# EAGLE schematic TestbedV2 (EAGLE 9.5.2)
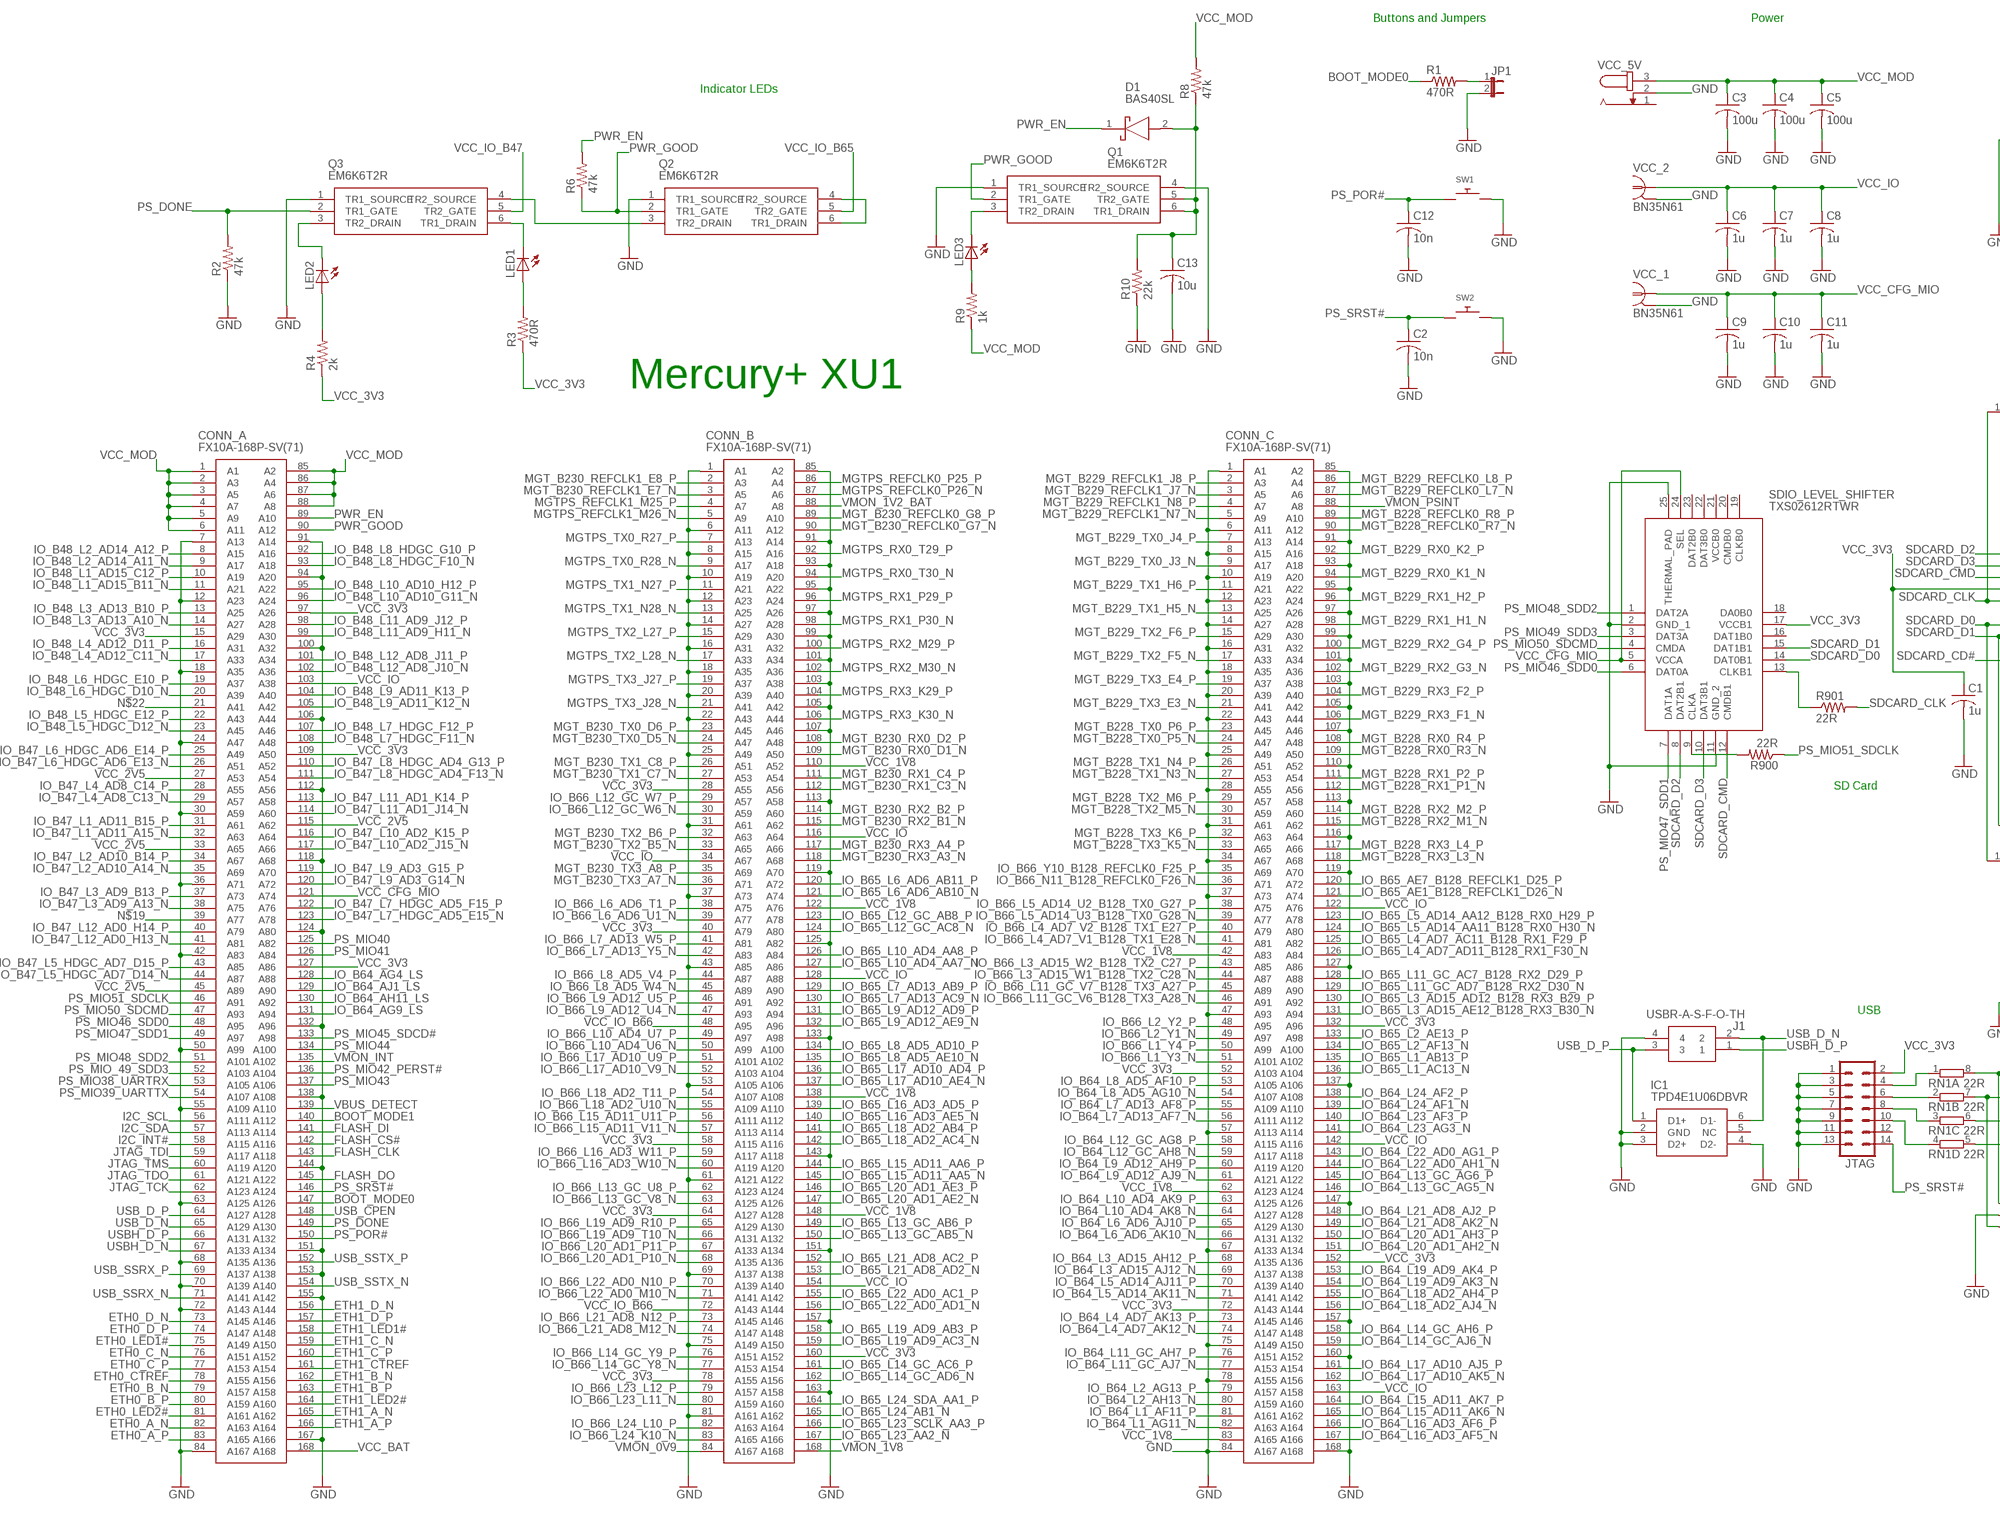
[diagram p0: schematic, sheet 1, part 1 of 2]
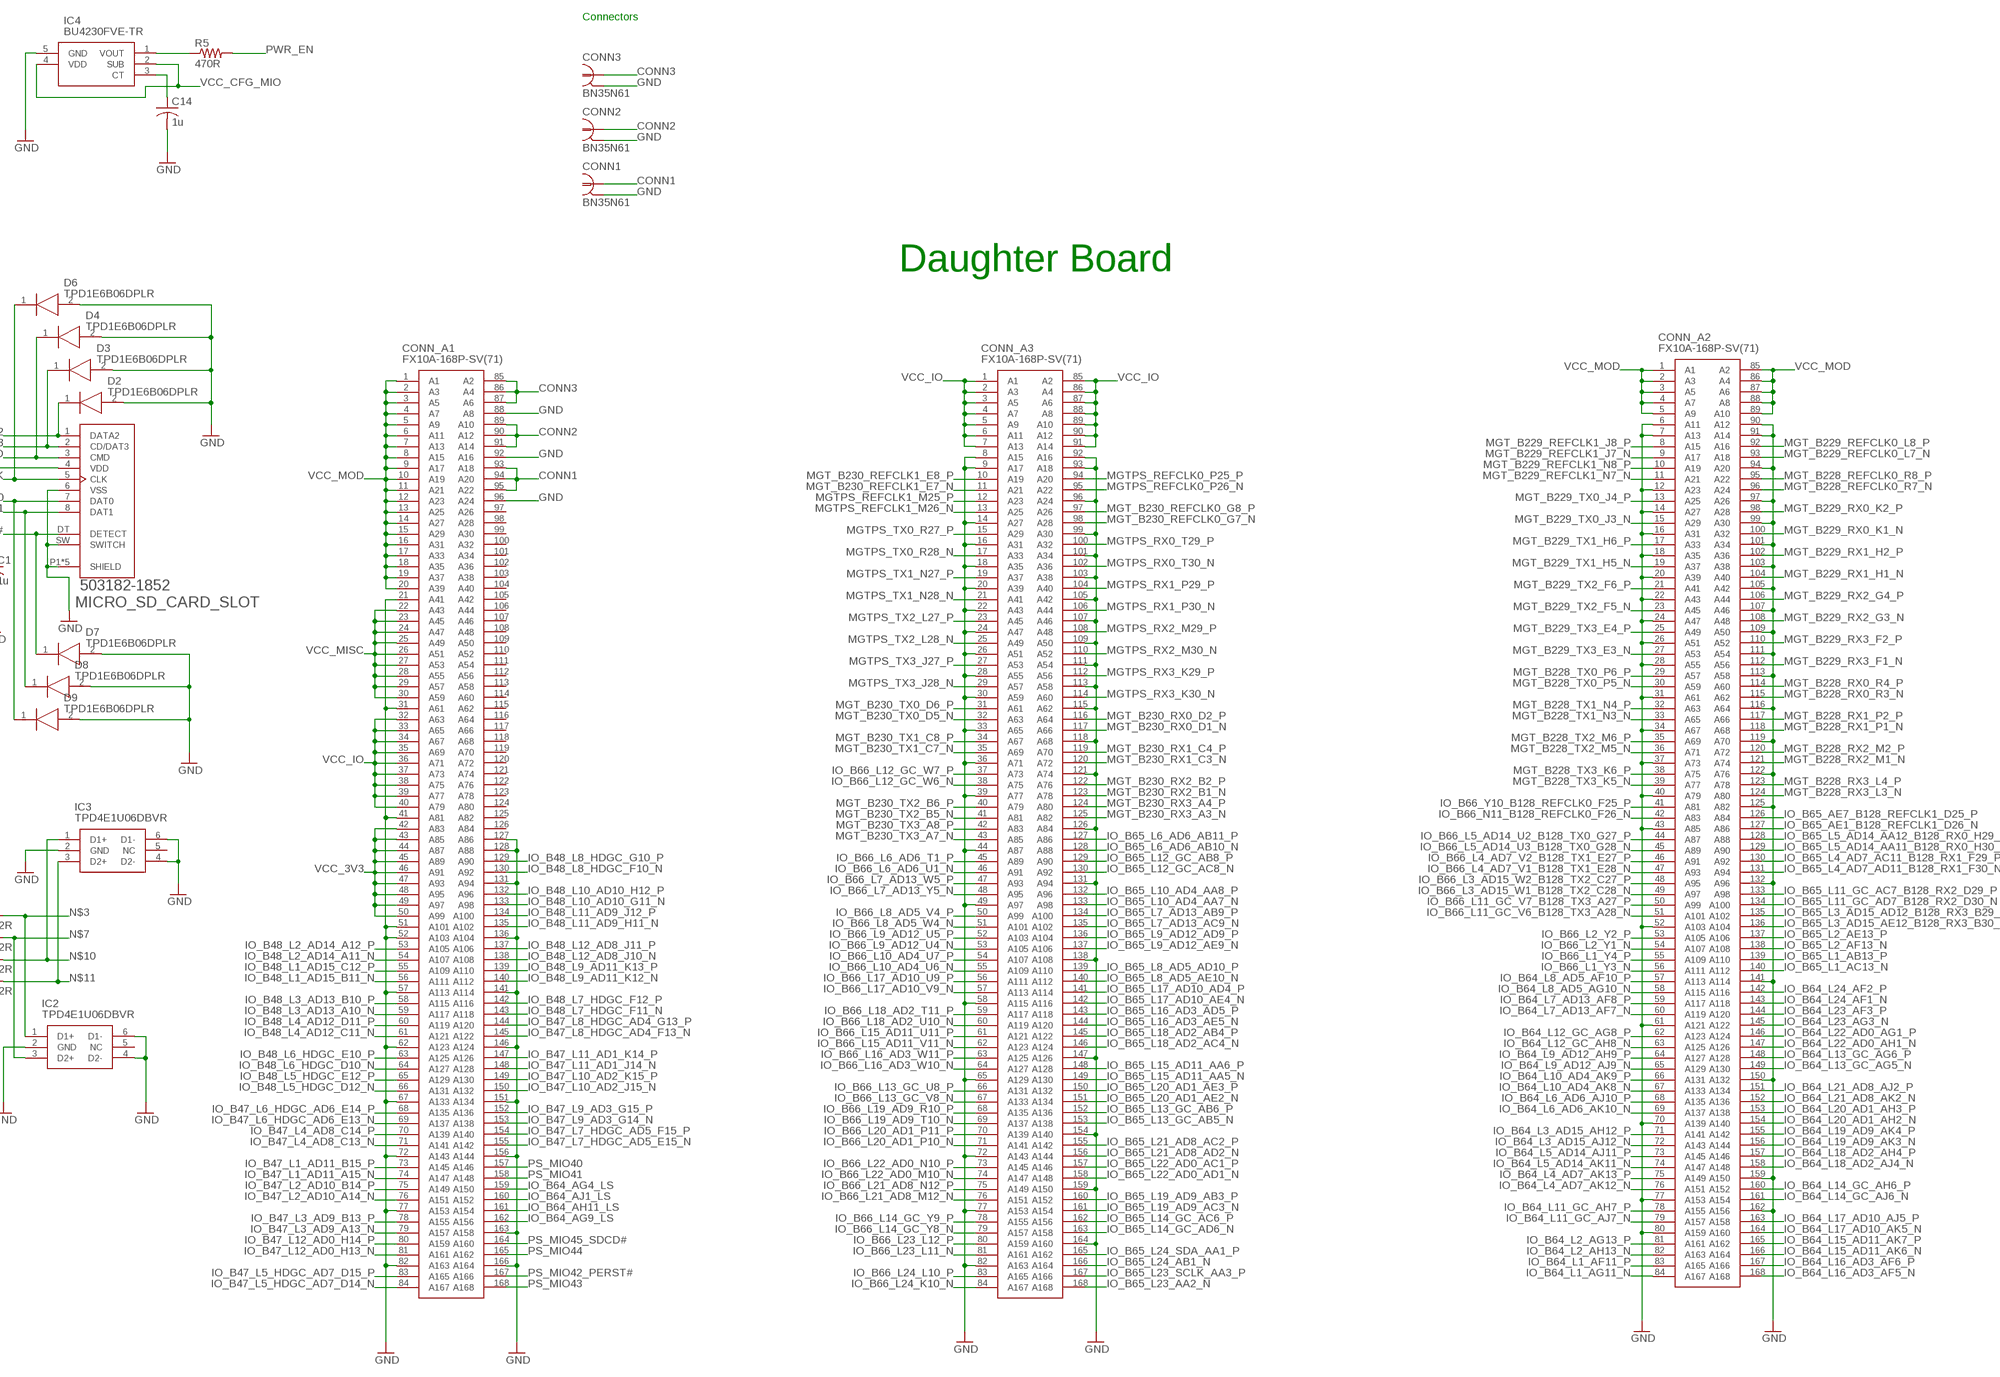
[diagram p1: schematic, sheet 1, part 2 of 2]

## Parts
C1  1u  C-USC0805  [C0805]
C2  10n  C-USC0805  [C0805]
C3  100u  C-USC0805  [C0805]
C4  100u  C-USC0805  [C0805]
C5  100u  C-USC0805  [C0805]
C6  1u  C-USC0805  [C0805]
C7  1u  C-USC0805  [C0805]
C8  1u  C-USC0805  [C0805]
C9  1u  C-USC0805  [C0805]
C10  1u  C-USC0805  [C0805]
C11  1u  C-USC0805  [C0805]
C12  10n  C-USC0805  [C0805]
C13  10u  C-USC0805  [C0805]
C14  1u  C-USC0805  [C0805]
CONN1  BN35N61  [B35N61]
CONN2  BN35N61  [B35N61]
CONN3  BN35N61  [B35N61]
CONN_A  FX10A-168P-SV(71)  [FX10A-168P-SV(71)]
CONN_A1  FX10A-168P-SV(71)  [FX10A-168P-SV(71)]
CONN_A2  FX10A-168P-SV(71)  [FX10A-168P-SV(71)]
CONN_A3  FX10A-168P-SV(71)  [FX10A-168P-SV(71)]
CONN_B  FX10A-168P-SV(71)  [FX10A-168P-SV(71)]
CONN_C  FX10A-168P-SV(71)  [FX10A-168P-SV(71)]
D1  BAS40SL  [SODFL1006X43N]
D2  TPD1E6B06DPLR  [DPL-(R-PX2SON-N2)]
D3  TPD1E6B06DPLR  [DPL-(R-PX2SON-N2)]
D4  TPD1E6B06DPLR  [DPL-(R-PX2SON-N2)]
D6  TPD1E6B06DPLR  [DPL-(R-PX2SON-N2)]
D7  TPD1E6B06DPLR  [DPL-(R-PX2SON-N2)]
D8  TPD1E6B06DPLR  [DPL-(R-PX2SON-N2)]
D9  TPD1E6B06DPLR  [DPL-(R-PX2SON-N2)]
IC1  TPD4E1U06DBVR  [SOT95P280X145-6N]
IC2  TPD4E1U06DBVR  [SOT95P280X145-6N]
IC3  TPD4E1U06DBVR  [SOT95P280X145-6N]
IC4  BU4230FVE-TR  [BU4230FVETR]
J1  USBR-A-S-F-O-TH  [USBR-A-S-F-O-TH]
JP1  JP1E  [JP1]
JTAG  MA07-2  [MA07-2]
LED1  LEDCHIP-LED0805  [CHIP-LED0805]
LED2  LEDCHIP-LED0805  [CHIP-LED0805]
LED3  LEDCHIP-LED0805  [CHIP-LED0805]
MICRO_SD_CARD_SLOT  503182-1852  [MOLEX_503182-1852]
Q1  EM6K6T2R  [SOTFL50P160X55-6N]
Q2  EM6K6T2R  [SOTFL50P160X55-6N]
Q3  EM6K6T2R  [SOTFL50P160X55-6N]
R1  470R  R-US_R0805  [R0805]
R2  47k  R-US_R0805  [R0805]
R3  470R  R-US_R0805  [R0805]
R4  2k  R-US_R0805  [R0805]
R5  470R  R-US_R0805  [R0805]
R6  47k  R-US_R0805  [R0805]
R8  47k  R-US_R0805  [R0805]
R9  1k  R-US_R0805  [R0805]
R10  22k  R-US_R0805  [R0805]
R900  22R  R-US_R0805  [R0805]
R901  22R  R-US_R0805  [R0805]
RN1  22R  4R-N0402ARV341  [4X0402ARV341]
SDIO_LEVEL_SHIFTER  TXS02612RTWR  [QFN50P400X400X80-25N]
SW1  SWITCH_PUSHBUTTONSOFTTOUCHSMD_SJ  [PUSHBUTTON_SMD_SJ]
SW2  SWITCH_PUSHBUTTONSOFTTOUCHSMD_SJ  [PUSHBUTTON_SMD_SJ]
VCC_1  BN35N61  [B35N61]
VCC_2  BN35N61  [B35N61]
VCC_5V  JACK-PLUG1  [SPC4078]

## Nets
BOOT_MODE0: CONN_A.147(A126) R1.1
BOOT_MODE1: CONN_A.140(A112)
CONN1: CONN1.1 CONN_A1.93(A18) CONN_A1.94(A20) CONN_A1.95(A22)
CONN2: CONN2.1 CONN_A1.89(A10) CONN_A1.90(A12) CONN_A1.91(A14)
CONN3: CONN3.1 CONN_A1.85(A2) CONN_A1.86(A4) CONN_A1.87(A6)
ETH0_A_N: CONN_A.82(A163)
ETH0_A_P: CONN_A.83(A165)
ETH0_B_N: CONN_A.79(A157)
ETH0_B_P: CONN_A.80(A159)
ETH0_C_N: CONN_A.76(A151)
ETH0_C_P: CONN_A.77(A153)
ETH0_CTREF: CONN_A.78(A155)
ETH0_D_N: CONN_A.73(A145)
ETH0_D_P: CONN_A.74(A147)
ETH0_LED1#: CONN_A.75(A149)
ETH0_LED2#: CONN_A.81(A161)
ETH1_A_N: CONN_A.165(A162)
ETH1_A_P: CONN_A.166(A164)
ETH1_B_N: CONN_A.162(A156)
ETH1_B_P: CONN_A.163(A158)
ETH1_C_N: CONN_A.159(A150)
ETH1_C_P: CONN_A.160(A152)
ETH1_CTREF: CONN_A.161(A154)
ETH1_D_N: CONN_A.156(A144)
ETH1_D_P: CONN_A.157(A146)
ETH1_LED1#: CONN_A.158(A148)
ETH1_LED2#: CONN_A.164(A160)
FLASH_CLK: CONN_A.143(A118)
FLASH_CS#: CONN_A.142(A116)
FLASH_DI: CONN_A.141(A114)
FLASH_DO: CONN_A.145(A122)
GND: C1.2 C2.2 C3.2 C4.2 C5.2 C6.2 C7.2 C8.2 C9.2 C10.2 C11.2 C12.2 C13.2 C14.2 CONN1.2 CONN1.3 CONN1.4 CONN1.5 CONN2.2 CONN2.3 CONN2.4 CONN2.5 CONN3.2 CONN3.3 CONN3.4 CONN3.5 CONN_A1.21(A41) CONN_A1.31(A61) CONN_A1.41(A81) CONN_A1.51(A101) CONN_A1.52(A103) CONN_A1.57(A113) CONN_A1.62(A123) CONN_A1.67(A133) CONN_A1.72(A143) CONN_A1.77(A153) CONN_A1.82(A163) CONN_A1.88(A8) CONN_A1.92(A16) CONN_A1.96(A24) CONN_A1.127(A86) CONN_A1.128(A88) CONN_A1.131(A94) CONN_A1.136(A104) CONN_A1.141(A114) CONN_A1.146(A124) CONN_A1.151(A134) CONN_A1.156(A144) CONN_A1.163(A158) CONN_A1.166(A164) CONN_A2.6(A11) CONN_A2.7(A13) CONN_A2.12(A23) CONN_A2.14(A27) CONN_A2.16(A31) CONN_A2.18(A35) CONN_A2.20(A39) CONN_A2.22(A43) CONN_A2.24(A47) CONN_A2.26(A51) CONN_A2.28(A55) CONN_A2.31(A61) CONN_A2.34(A67) CONN_A2.37(A73) CONN_A2.40(A79) CONN_A2.43(A85) CONN_A2.52(A103) CONN_A2.61(A121) CONN_A2.70(A139) CONN_A2.77(A153) CONN_A2.80(A159) CONN_A2.90(A12) CONN_A2.91(A14) CONN_A2.94(A20) CONN_A2.97(A26) CONN_A2.99(A30) CONN_A2.101(A34) CONN_A2.103(A38) CONN_A2.105(A42) CONN_A2.107(A46) CONN_A2.109(A50) CONN_A2.111(A54) CONN_A2.113(A58) CONN_A2.116(A64) CONN_A2.119(A70) CONN_A2.122(A76) CONN_A2.125(A82) CONN_A2.132(A96) CONN_A2.141(A114) CONN_A2.150(A132) CONN_A2.159(A150) CONN_A2.162(A156) CONN_A3.8(A15) CONN_A3.9(A17) CONN_A3.14(A27) CONN_A3.16(A31) CONN_A3.18(A35) CONN_A3.20(A39) CONN_A3.22(A43) CONN_A3.24(A47) CONN_A3.26(A51) CONN_A3.28(A55) CONN_A3.30(A59) CONN_A3.33(A65) CONN_A3.36(A71) CONN_A3.39(A77) CONN_A3.44(A87) CONN_A3.49(A97) CONN_A3.58(A115) CONN_A3.65(A129) CONN_A3.72(A143) CONN_A3.77(A153) CONN_A3.82(A163) CONN_A3.92(A16) CONN_A3.93(A18) CONN_A3.96(A24) CONN_A3.99(A30) CONN_A3.101(A34) CONN_A3.103(A38) CONN_A3.105(A42) CONN_A3.107(A46) CONN_A3.109(A50) CONN_A3.111(A54) CONN_A3.113(A58) CONN_A3.115(A62) CONN_A3.118(A68) CONN_A3.121(A74) CONN_A3.126(A84) CONN_A3.131(A94) CONN_A3.138(A108) CONN_A3.147(A126) CONN_A3.154(A140) CONN_A3.159(A150) CONN_A3.164(A160) CONN_A.7(A13) CONN_A.12(A23) CONN_A.18(A35) CONN_A.24(A47) CONN_A.30(A59) CONN_A.36(A71) CONN_A.42(A83) CONN_A.50(A99) CONN_A.55(A109) CONN_A.63(A125) CONN_A.68(A135) CONN_A.70(A139) CONN_A.72(A143) CONN_A.84(A167) CONN_A.91(A14) CONN_A.94(A20) CONN_A.100(A32) CONN_A.106(A44) CONN_A.112(A56) CONN_A.118(A68) CONN_A.124(A80) CONN_A.132(A96) CONN_A.138(A108) CONN_A.144(A120) CONN_A.151(A134) CONN_A.153(A138) CONN_A.155(A142) CONN_A.167(A166) CONN_B.1(A1) CONN_B.6(A11) CONN_B.8(A15) CONN_B.10(A19) CONN_B.12(A23) CONN_B.14(A27) CONN_B.16(A31) CONN_B.18(A35) CONN_B.20(A39) CONN_B.22(A43) CONN_B.25(A49) CONN_B.31(A61) CONN_B.37(A73) CONN_B.43(A85) CONN_B.53(A105) CONN_B.61(A121) CONN_B.69(A137) CONN_B.75(A149) CONN_B.81(A161) CONN_B.85(A2) CONN_B.91(A14) CONN_B.93(A18) CONN_B.95(A22) CONN_B.97(A26) CONN_B.99(A30) CONN_B.101(A34) CONN_B.103(A38) CONN_B.105(A42) CONN_B.107(A46) CONN_B.113(A58) CONN_B.119(A70) CONN_B.125(A82) CONN_B.133(A98) CONN_B.143(A118) CONN_B.151(A134) CONN_B.157(A146) CONN_B.163(A158) CONN_C.1(A1) CONN_C.6(A11) CONN_C.8(A15) CONN_C.10(A19) CONN_C.12(A23) CONN_C.14(A27) CONN_C.16(A31) CONN_C.18(A35) CONN_C.20(A39) CONN_C.22(A43) CONN_C.25(A49) CONN_C.28(A55) CONN_C.31(A61) CONN_C.34(A67) CONN_C.37(A73) CONN_C.47(A93) CONN_C.57(A113) CONN_C.67(A133) CONN_C.75(A149) CONN_C.78(A155) CONN_C.84(A167) CONN_C.85(A2) CONN_C.91(A14) CONN_C.93(A18) CONN_C.95(A22) CONN_C.97(A26) CONN_C.99(A30) CONN_C.101(A34) CONN_C.103(A38) CONN_C.105(A42) CONN_C.107(A46) CONN_C.110(A52) CONN_C.113(A58) CONN_C.116(A64) CONN_C.119(A70) CONN_C.127(A86) CONN_C.137(A106) CONN_C.147(A126) CONN_C.157(A146) CONN_C.160(A152) CONN_C.168(A168) D2.2(I/O) D3.2(I/O) D4.2(I/O) D6.2(I/O) D7.2(I/O) D8.2(I/O) D9.2(I/O) IC1.2(GND) IC1.3(D2+) IC1.4(D2-) IC2.2(GND) IC2.4(D2-) IC2.6(D1-) IC3.2(GND) IC3.4(D2-) IC3.6(D1-) IC4.5(GND) J1.4 JP1.2 JTAG.1 JTAG.3 JTAG.5 JTAG.7 JTAG.9 JTAG.11 JTAG.13 MICRO_SD_CARD_SLOT.6(VSS) MICRO_SD_CARD_SLOT.P1(SHIELD) MICRO_SD_CARD_SLOT.P2(SHIELD) MICRO_SD_CARD_SLOT.P3(SHIELD) MICRO_SD_CARD_SLOT.P4(SHIELD) MICRO_SD_CARD_SLOT.P5(SHIELD) MICRO_SD_CARD_SLOT.SW(SWITCH) Q1.1(TR1_SOURCE) Q1.4(TR2_SOURCE) Q2.1(TR1_SOURCE) Q3.1(TR1_SOURCE) R2.1 R10.1 SDIO_LEVEL_SHIFTER.2(GND_1) SDIO_LEVEL_SHIFTER.11(GND_2) SDIO_LEVEL_SHIFTER.25(THERMAL_PAD) SW1.P$2 SW2.P$2 VCC_1.2 VCC_1.3 VCC_1.4 VCC_1.5 VCC_2.2 VCC_2.3 VCC_2.4 VCC_2.5 VCC_5V.2
I2C_INT#: CONN_A.58(A115)
I2C_SCL: CONN_A.56(A111)
I2C_SDA: CONN_A.57(A113)
IO_B47_L1_AD11_A15_N: CONN_A1.74(A147) CONN_A.32(A63)
IO_B47_L1_AD11_B15_P: CONN_A1.73(A145) CONN_A.31(A61)
IO_B47_L2_AD10_A14_N: CONN_A1.76(A151) CONN_A.35(A69)
IO_B47_L2_AD10_B14_P: CONN_A1.75(A149) CONN_A.34(A67)
IO_B47_L3_AD9_A13_N: CONN_A1.79(A157) CONN_A.38(A75)
IO_B47_L3_AD9_B13_P: CONN_A1.78(A155) CONN_A.37(A73)
IO_B47_L4_AD8_C13_N: CONN_A1.71(A141) CONN_A.29(A57)
IO_B47_L4_AD8_C14_P: CONN_A1.70(A139) CONN_A.28(A55)
IO_B47_L5_HDGC_AD7_D14_N: CONN_A1.84(A167) CONN_A.44(A87)
IO_B47_L5_HDGC_AD7_D15_P: CONN_A1.83(A165) CONN_A.43(A85)
IO_B47_L6_HDGC_AD6_E13_N: CONN_A1.69(A137) CONN_A.26(A51)
IO_B47_L6_HDGC_AD6_E14_P: CONN_A1.68(A135) CONN_A.25(A49)
IO_B47_L7_HDGC_AD5_E15_N: CONN_A1.155(A142) CONN_A.123(A78)
IO_B47_L7_HDGC_AD5_F15_P: CONN_A1.154(A140) CONN_A.122(A76)
IO_B47_L8_HDGC_AD4_F13_N: CONN_A1.145(A122) CONN_A.111(A54)
IO_B47_L8_HDGC_AD4_G13_P: CONN_A1.144(A120) CONN_A.110(A52)
IO_B47_L9_AD3_G14_N: CONN_A1.153(A138) CONN_A.120(A72)
IO_B47_L9_AD3_G15_P: CONN_A1.152(A136) CONN_A.119(A70)
IO_B47_L10_AD2_J15_N: CONN_A1.150(A132) CONN_A.117(A66)
IO_B47_L10_AD2_K15_P: CONN_A1.149(A130) CONN_A.116(A64)
IO_B47_L11_AD1_J14_N: CONN_A1.148(A128) CONN_A.114(A60)
IO_B47_L11_AD1_K14_P: CONN_A1.147(A126) CONN_A.113(A58)
IO_B47_L12_AD0_H13_N: CONN_A1.81(A161) CONN_A.41(A81)
IO_B47_L12_AD0_H14_P: CONN_A1.80(A159) CONN_A.40(A79)
IO_B48_L1_AD15_B11_N: CONN_A1.56(A111) CONN_A.11(A21)
IO_B48_L1_AD15_C12_P: CONN_A1.55(A109) CONN_A.10(A19)
IO_B48_L2_AD14_A11_N: CONN_A1.54(A107) CONN_A.9(A17)
IO_B48_L2_AD14_A12_P: CONN_A1.53(A105) CONN_A.8(A15)
IO_B48_L3_AD13_A10_N: CONN_A1.59(A117) CONN_A.14(A27)
IO_B48_L3_AD13_B10_P: CONN_A1.58(A115) CONN_A.13(A25)
IO_B48_L4_AD12_C11_N: CONN_A1.61(A121) CONN_A.17(A33)
IO_B48_L4_AD12_D11_P: CONN_A1.60(A119) CONN_A.16(A31)
IO_B48_L5_HDGC_D12_N: CONN_A1.66(A131) CONN_A.23(A45)
IO_B48_L5_HDGC_E12_P: CONN_A1.65(A129) CONN_A.22(A43)
IO_B48_L6_HDGC_D10_N: CONN_A1.64(A127) CONN_A.20(A39)
IO_B48_L6_HDGC_E10_P: CONN_A1.63(A125) CONN_A.19(A37)
IO_B48_L7_HDGC_F11_N: CONN_A1.143(A118) CONN_A.108(A48)
IO_B48_L7_HDGC_F12_P: CONN_A1.142(A116) CONN_A.107(A46)
IO_B48_L8_HDGC_F10_N: CONN_A1.130(A92) CONN_A.93(A18)
IO_B48_L8_HDGC_G10_P: CONN_A1.129(A90) CONN_A.92(A16)
IO_B48_L9_AD11_K12_N: CONN_A1.140(A112) CONN_A.105(A42)
IO_B48_L9_AD11_K13_P: CONN_A1.139(A110) CONN_A.104(A40)
IO_B48_L10_AD10_G11_N: CONN_A1.133(A98) CONN_A.96(A24)
IO_B48_L10_AD10_H12_P: CONN_A1.132(A96) CONN_A.95(A22)
IO_B48_L11_AD9_H11_N: CONN_A1.135(A102) CONN_A.99(A30)
IO_B48_L11_AD9_J12_P: CONN_A1.134(A100) CONN_A.98(A28)
IO_B48_L12_AD8_J10_N: CONN_A1.138(A108) CONN_A.102(A36)
IO_B48_L12_AD8_J11_P: CONN_A1.137(A106) CONN_A.101(A34)
IO_B64_AG4_LS: CONN_A1.159(A150) CONN_A.128(A88)
IO_B64_AG9_LS: CONN_A1.162(A156) CONN_A.131(A94)
IO_B64_AH11_LS: CONN_A1.161(A154) CONN_A.130(A92)
IO_B64_AJ1_LS: CONN_A1.160(A152) CONN_A.129(A90)
IO_B64_L1_AF11_P: CONN_A2.83(A165) CONN_C.81(A161)
IO_B64_L1_AG11_N: CONN_A2.84(A167) CONN_C.82(A163)
IO_B64_L2_AG13_P: CONN_A2.81(A161) CONN_C.79(A157)
IO_B64_L2_AH13_N: CONN_A2.82(A163) CONN_C.80(A159)
IO_B64_L3_AD15_AH12_P: CONN_A2.71(A141) CONN_C.68(A135)
IO_B64_L3_AD15_AJ12_N: CONN_A2.72(A143) CONN_C.69(A137)
IO_B64_L4_AD7_AK12_N: CONN_A2.76(A151) CONN_C.74(A147)
IO_B64_L4_AD7_AK13_P: CONN_A2.75(A149) CONN_C.73(A145)
IO_B64_L5_AD14_AJ11_P: CONN_A2.73(A145) CONN_C.70(A139)
IO_B64_L5_AD14_AK11_N: CONN_A2.74(A147) CONN_C.71(A141)
IO_B64_L6_AD6_AJ10_P: CONN_A2.68(A135) CONN_C.65(A129)
IO_B64_L6_AD6_AK10_N: CONN_A2.69(A137) CONN_C.66(A131)
IO_B64_L7_AD13_AF7_N: CONN_A2.60(A119) CONN_C.56(A111)
IO_B64_L7_AD13_AF8_P: CONN_A2.59(A117) CONN_C.55(A109)
IO_B64_L8_AD5_AF10_P: CONN_A2.57(A113) CONN_C.53(A105)
IO_B64_L8_AD5_AG10_N: CONN_A2.58(A115) CONN_C.54(A107)
IO_B64_L9_AD12_AH9_P: CONN_A2.64(A127) CONN_C.60(A119)
IO_B64_L9_AD12_AJ9_N: CONN_A2.65(A129) CONN_C.61(A121)
IO_B64_L10_AD4_AK8_N: CONN_A2.67(A133) CONN_C.64(A127)
IO_B64_L10_AD4_AK9_P: CONN_A2.66(A131) CONN_C.63(A125)
IO_B64_L11_GC_AH7_P: CONN_A2.78(A155) CONN_C.76(A151)
IO_B64_L11_GC_AJ7_N: CONN_A2.79(A157) CONN_C.77(A153)
IO_B64_L12_GC_AG8_P: CONN_A2.62(A123) CONN_C.58(A115)
IO_B64_L12_GC_AH8_N: CONN_A2.63(A125) CONN_C.59(A117)
IO_B64_L13_GC_AG5_N: CONN_A2.149(A130) CONN_C.146(A124)
IO_B64_L13_GC_AG6_P: CONN_A2.148(A128) CONN_C.145(A122)
IO_B64_L14_GC_AH6_P: CONN_A2.160(A152) CONN_C.158(A148)
IO_B64_L14_GC_AJ6_N: CONN_A2.161(A154) CONN_C.159(A150)
IO_B64_L15_AD11_AK6_N: CONN_A2.166(A164) CONN_C.165(A162)
IO_B64_L15_AD11_AK7_P: CONN_A2.165(A162) CONN_C.164(A160)
IO_B64_L16_AD3_AF5_N: CONN_A2.168(A168) CONN_C.167(A166)
IO_B64_L16_AD3_AF6_P: CONN_A2.167(A166) CONN_C.166(A164)
IO_B64_L17_AD10_AJ5_P: CONN_A2.163(A158) CONN_C.161(A154)
IO_B64_L17_AD10_AK5_N: CONN_A2.164(A160) CONN_C.162(A156)
IO_B64_L18_AD2_AH4_P: CONN_A2.157(A146) CONN_C.155(A142)
IO_B64_L18_AD2_AJ4_N: CONN_A2.158(A148) CONN_C.156(A144)
IO_B64_L19_AD9_AK3_N: CONN_A2.156(A144) CONN_C.154(A140)
IO_B64_L19_AD9_AK4_P: CONN_A2.155(A142) CONN_C.153(A138)
IO_B64_L20_AD1_AH2_N: CONN_A2.154(A140) CONN_C.151(A134)
IO_B64_L20_AD1_AH3_P: CONN_A2.153(A138) CONN_C.150(A132)
IO_B64_L21_AD8_AJ2_P: CONN_A2.151(A134) CONN_C.148(A128)
IO_B64_L21_AD8_AK2_N: CONN_A2.152(A136) CONN_C.149(A130)
IO_B64_L22_AD0_AG1_P: CONN_A2.146(A124) CONN_C.143(A118)
IO_B64_L22_AD0_AH1_N: CONN_A2.147(A126) CONN_C.144(A120)
IO_B64_L23_AF3_P: CONN_A2.144(A120) CONN_C.140(A112)
IO_B64_L23_AG3_N: CONN_A2.145(A122) CONN_C.141(A114)
IO_B64_L24_AF1_N: CONN_A2.143(A118) CONN_C.139(A110)
IO_B64_L24_AF2_P: CONN_A2.142(A116) CONN_C.138(A108)
IO_B65_AE1_B128_REFCLK1_D26_N: CONN_A2.127(A86) CONN_C.121(A74)
IO_B65_AE7_B128_REFCLK1_D25_P: CONN_A2.126(A84) CONN_C.120(A72)
IO_B65_L1_AB13_P: CONN_A2.139(A110) CONN_C.135(A102)
IO_B65_L1_AC13_N: CONN_A2.140(A112) CONN_C.136(A104)
IO_B65_L2_AE13_P: CONN_A2.137(A106) CONN_C.133(A98)
IO_B65_L2_AF13_N: CONN_A2.138(A108) CONN_C.134(A100)
IO_B65_L3_AD15_AD12_B128_RX3_B29_P: CONN_A2.135(A102) CONN_C.130(A92)
IO_B65_L3_AD15_AE12_B128_RX3_B30_N: CONN_A2.136(A104) CONN_C.131(A94)
IO_B65_L4_AD7_AC11_B128_RX1_F29_P: CONN_A2.130(A92) CONN_C.125(A82)
IO_B65_L4_AD7_AD11_B128_RX1_F30_N: CONN_A2.131(A94) CONN_C.126(A84)
IO_B65_L5_AD14_AA11_B128_RX0_H30_N: CONN_A2.129(A90) CONN_C.124(A80)
IO_B65_L5_AD14_AA12_B128_RX0_H29_P: CONN_A2.128(A88) CONN_C.123(A78)
IO_B65_L6_AD6_AB10_N: CONN_A3.128(A88) CONN_B.121(A74)
IO_B65_L6_AD6_AB11_P: CONN_A3.127(A86) CONN_B.120(A72)
IO_B65_L7_AD13_AB9_P: CONN_A3.134(A100) CONN_B.129(A90)
IO_B65_L7_AD13_AC9_N: CONN_A3.135(A102) CONN_B.130(A92)
IO_B65_L8_AD5_AD10_P: CONN_A3.139(A110) CONN_B.134(A100)
IO_B65_L8_AD5_AE10_N: CONN_A3.140(A112) CONN_B.135(A102)
IO_B65_L9_AD12_AD9_P: CONN_A3.136(A104) CONN_B.131(A94)
IO_B65_L9_AD12_AE9_N: CONN_A3.137(A106) CONN_B.132(A96)
IO_B65_L10_AD4_AA7_N: CONN_A3.133(A98) CONN_B.127(A86)
IO_B65_L10_AD4_AA8_P: CONN_A3.132(A96) CONN_B.126(A84)
IO_B65_L11_GC_AC7_B128_RX2_D29_P: CONN_A2.133(A98) CONN_C.128(A88)
IO_B65_L11_GC_AD7_B128_RX2_D30_N: CONN_A2.134(A100) CONN_C.129(A90)
IO_B65_L12_GC_AB8_P: CONN_A3.129(A90) CONN_B.123(A78)
IO_B65_L12_GC_AC8_N: CONN_A3.130(A92) CONN_B.124(A80)
IO_B65_L13_GC_AB5_N: CONN_A3.153(A138) CONN_B.150(A132)
IO_B65_L13_GC_AB6_P: CONN_A3.152(A136) CONN_B.149(A130)
IO_B65_L14_GC_AC6_P: CONN_A3.162(A156) CONN_B.161(A154)
IO_B65_L14_GC_AD6_N: CONN_A3.163(A158) CONN_B.162(A156)
IO_B65_L15_AD11_AA5_N: CONN_A3.149(A130) CONN_B.145(A122)
IO_B65_L15_AD11_AA6_P: CONN_A3.148(A128) CONN_B.144(A120)
IO_B65_L16_AD3_AD5_P: CONN_A3.143(A118) CONN_B.139(A110)
IO_B65_L16_AD3_AE5_N: CONN_A3.144(A120) CONN_B.140(A112)
IO_B65_L17_AD10_AD4_P: CONN_A3.141(A114) CONN_B.136(A104)
IO_B65_L17_AD10_AE4_N: CONN_A3.142(A116) CONN_B.137(A106)
IO_B65_L18_AD2_AB4_P: CONN_A3.145(A122) CONN_B.141(A114)
IO_B65_L18_AD2_AC4_N: CONN_A3.146(A124) CONN_B.142(A116)
IO_B65_L19_AD9_AB3_P: CONN_A3.160(A152) CONN_B.158(A148)
IO_B65_L19_AD9_AC3_N: CONN_A3.161(A154) CONN_B.159(A150)
IO_B65_L20_AD1_AE2_N: CONN_A3.151(A134) CONN_B.147(A126)
IO_B65_L20_AD1_AE3_P: CONN_A3.150(A132) CONN_B.146(A124)
IO_B65_L21_AD8_AC2_P: CONN_A3.155(A142) CONN_B.152(A136)
IO_B65_L21_AD8_AD2_N: CONN_A3.156(A144) CONN_B.153(A138)
IO_B65_L22_AD0_AC1_P: CONN_A3.157(A146) CONN_B.155(A142)
IO_B65_L22_AD0_AD1_N: CONN_A3.158(A148) CONN_B.156(A144)
IO_B65_L23_AA2_N: CONN_A3.168(A168) CONN_B.167(A166)
IO_B65_L23_SCLK_AA3_P: CONN_A3.167(A166) CONN_B.166(A164)
IO_B65_L24_AB1_N: CONN_A3.166(A164) CONN_B.165(A162)
IO_B65_L24_SDA_AA1_P: CONN_A3.165(A162) CONN_B.164(A160)
IO_B66_L1_Y3_N: CONN_A2.56(A111) CONN_C.51(A101)
IO_B66_L1_Y4_P: CONN_A2.55(A109) CONN_C.50(A99)
IO_B66_L2_Y1_N: CONN_A2.54(A107) CONN_C.49(A97)
IO_B66_L2_Y2_P: CONN_A2.53(A105) CONN_C.48(A95)
IO_B66_L3_AD15_W1_B128_TX2_C28_N: CONN_A2.49(A97) CONN_C.44(A87)
IO_B66_L3_AD15_W2_B128_TX2_C27_P: CONN_A2.48(A95) CONN_C.43(A85)
IO_B66_L4_AD7_V1_B128_TX1_E28_N: CONN_A2.47(A93) CONN_C.41(A81)
IO_B66_L4_AD7_V2_B128_TX1_E27_P: CONN_A2.46(A91) CONN_C.40(A79)
IO_B66_L5_AD14_U2_B128_TX0_G27_P: CONN_A2.44(A87) CONN_C.38(A75)
IO_B66_L5_AD14_U3_B128_TX0_G28_N: CONN_A2.45(A89) CONN_C.39(A77)
IO_B66_L6_AD6_T1_P: CONN_A3.45(A89) CONN_B.38(A75)
IO_B66_L6_AD6_U1_N: CONN_A3.46(A91) CONN_B.39(A77)
IO_B66_L7_AD13_W5_P: CONN_A3.47(A93) CONN_B.41(A81)
IO_B66_L7_AD13_Y5_N: CONN_A3.48(A95) CONN_B.42(A83)
IO_B66_L8_AD5_V4_P: CONN_A3.50(A99) CONN_B.44(A87)
IO_B66_L8_AD5_W4_N: CONN_A3.51(A101) CONN_B.45(A89)
IO_B66_L9_AD12_U4_N: CONN_A3.53(A105) CONN_B.47(A93)
IO_B66_L9_AD12_U5_P: CONN_A3.52(A103) CONN_B.46(A91)
IO_B66_L10_AD4_U6_N: CONN_A3.55(A109) CONN_B.50(A99)
IO_B66_L10_AD4_U7_P: CONN_A3.54(A107) CONN_B.49(A97)
IO_B66_L11_GC_V6_B128_TX3_A28_N: CONN_A2.51(A101) CONN_C.46(A91)
IO_B66_L11_GC_V7_B128_TX3_A27_P: CONN_A2.50(A99) CONN_C.45(A89)
IO_B66_L12_GC_W6_N: CONN_A3.38(A75) CONN_B.30(A59)
IO_B66_L12_GC_W7_P: CONN_A3.37(A73) CONN_B.29(A57)
IO_B66_L13_GC_U8_P: CONN_A3.66(A131) CONN_B.62(A123)
IO_B66_L13_GC_V8_N: CONN_A3.67(A133) CONN_B.63(A125)
IO_B66_L14_GC_Y8_N: CONN_A3.79(A157) CONN_B.77(A153)
IO_B66_L14_GC_Y9_P: CONN_A3.78(A155) CONN_B.76(A151)
IO_B66_L15_AD11_U11_P: CONN_A3.61(A121) CONN_B.56(A111)
IO_B66_L15_AD11_V11_N: CONN_A3.62(A123) CONN_B.57(A113)
IO_B66_L16_AD3_W10_N: CONN_A3.64(A127) CONN_B.60(A119)
IO_B66_L16_AD3_W11_P: CONN_A3.63(A125) CONN_B.59(A117)
IO_B66_L17_AD10_U9_P: CONN_A3.56(A111) CONN_B.51(A101)
IO_B66_L17_AD10_V9_N: CONN_A3.57(A113) CONN_B.52(A103)
IO_B66_L18_AD2_T11_P: CONN_A3.59(A117) CONN_B.54(A107)
IO_B66_L18_AD2_U10_N: CONN_A3.60(A119) CONN_B.55(A109)
IO_B66_L19_AD9_R10_P: CONN_A3.68(A135) CONN_B.65(A129)
IO_B66_L19_AD9_T10_N: CONN_A3.69(A137) CONN_B.66(A131)
IO_B66_L20_AD1_P10_N: CONN_A3.71(A141) CONN_B.68(A135)
IO_B66_L20_AD1_P11_P: CONN_A3.70(A139) CONN_B.67(A133)
IO_B66_L21_AD8_M12_N: CONN_A3.76(A151) CONN_B.74(A147)
IO_B66_L21_AD8_N12_P: CONN_A3.75(A149) CONN_B.73(A145)
IO_B66_L22_AD0_M10_N: CONN_A3.74(A147) CONN_B.71(A141)
IO_B66_L22_AD0_N10_P: CONN_A3.73(A145) CONN_B.70(A139)
IO_B66_L23_L11_N: CONN_A3.81(A161) CONN_B.80(A159)
IO_B66_L23_L12_P: CONN_A3.80(A159) CONN_B.79(A157)
IO_B66_L24_K10_N: CONN_A3.84(A167) CONN_B.83(A165)
IO_B66_L24_L10_P: CONN_A3.83(A165) CONN_B.82(A163)
IO_B66_N11_B128_REFCLK0_F26_N: CONN_A2.42(A83) CONN_C.36(A71)
IO_B66_Y10_B128_REFCLK0_F25_P: CONN_A2.41(A81) CONN_C.35(A69)
JTAG_TCK: CONN_A.62(A123)
JTAG_TDI: CONN_A.59(A117)
JTAG_TDO: CONN_A.61(A121)
JTAG_TMS: CONN_A.60(A119)
MGT_B228_REFCLK0_R7_N: CONN_A2.96(A24) CONN_C.90(A12)
MGT_B228_REFCLK0_R8_P: CONN_A2.95(A22) CONN_C.89(A10)
MGT_B228_RX0_R3_N: CONN_A2.115(A62) CONN_C.109(A50)
MGT_B228_RX0_R4_P: CONN_A2.114(A60) CONN_C.108(A48)
MGT_B228_RX1_P1_N: CONN_A2.118(A68) CONN_C.112(A56)
MGT_B228_RX1_P2_P: CONN_A2.117(A66) CONN_C.111(A54)
MGT_B228_RX2_M1_N: CONN_A2.121(A74) CONN_C.115(A62)
MGT_B228_RX2_M2_P: CONN_A2.120(A72) CONN_C.114(A60)
MGT_B228_RX3_L3_N: CONN_A2.124(A80) CONN_C.118(A68)
MGT_B228_RX3_L4_P: CONN_A2.123(A78) CONN_C.117(A66)
MGT_B228_TX0_P5_N: CONN_A2.30(A59) CONN_C.24(A47)
MGT_B228_TX0_P6_P: CONN_A2.29(A57) CONN_C.23(A45)
MGT_B228_TX1_N3_N: CONN_A2.33(A65) CONN_C.27(A53)
MGT_B228_TX1_N4_P: CONN_A2.32(A63) CONN_C.26(A51)
MGT_B228_TX2_M5_N: CONN_A2.36(A71) CONN_C.30(A59)
MGT_B228_TX2_M6_P: CONN_A2.35(A69) CONN_C.29(A57)
MGT_B228_TX3_K5_N: CONN_A2.39(A77) CONN_C.33(A65)
MGT_B228_TX3_K6_P: CONN_A2.38(A75) CONN_C.32(A63)
MGT_B229_REFCLK0_L7_N: CONN_A2.93(A18) CONN_C.87(A6)
MGT_B229_REFCLK0_L8_P: CONN_A2.92(A16) CONN_C.86(A4)
MGT_B229_REFCLK1_J7_N: CONN_A2.9(A17) CONN_C.3(A5)
MGT_B229_REFCLK1_J8_P: CONN_A2.8(A15) CONN_C.2(A3)
MGT_B229_REFCLK1_N7_N: CONN_A2.11(A21) CONN_C.5(A9)
MGT_B229_REFCLK1_N8_P: CONN_A2.10(A19) CONN_C.4(A7)
MGT_B229_RX0_K1_N: CONN_A2.100(A32) CONN_C.94(A20)
MGT_B229_RX0_K2_P: CONN_A2.98(A28) CONN_C.92(A16)
MGT_B229_RX1_H1_N: CONN_A2.104(A40) CONN_C.98(A28)
MGT_B229_RX1_H2_P: CONN_A2.102(A36) CONN_C.96(A24)
MGT_B229_RX2_G3_N: CONN_A2.108(A48) CONN_C.102(A36)
MGT_B229_RX2_G4_P: CONN_A2.106(A44) CONN_C.100(A32)
MGT_B229_RX3_F1_N: CONN_A2.112(A56) CONN_C.106(A44)
MGT_B229_RX3_F2_P: CONN_A2.110(A52) CONN_C.104(A40)
MGT_B229_TX0_J3_N: CONN_A2.15(A29) CONN_C.9(A17)
MGT_B229_TX0_J4_P: CONN_A2.13(A25) CONN_C.7(A13)
MGT_B229_TX1_H5_N: CONN_A2.19(A37) CONN_C.13(A25)
MGT_B229_TX1_H6_P: CONN_A2.17(A33) CONN_C.11(A21)
MGT_B229_TX2_F5_N: CONN_A2.23(A45) CONN_C.17(A33)
MGT_B229_TX2_F6_P: CONN_A2.21(A41) CONN_C.15(A29)
MGT_B229_TX3_E3_N: CONN_A2.27(A53) CONN_C.21(A41)
MGT_B229_TX3_E4_P: CONN_A2.25(A49) CONN_C.19(A37)
MGT_B230_REFCLK0_G7_N: CONN_A3.98(A28) CONN_B.90(A12)
MGT_B230_REFCLK0_G8_P: CONN_A3.97(A26) CONN_B.89(A10)
MGT_B230_REFCLK1_E7_N: CONN_A3.11(A21) CONN_B.3(A5)
MGT_B230_REFCLK1_E8_P: CONN_A3.10(A19) CONN_B.2(A3)
MGT_B230_RX0_D1_N: CONN_A3.117(A66) CONN_B.109(A50)
MGT_B230_RX0_D2_P: CONN_A3.116(A64) CONN_B.108(A48)
MGT_B230_RX1_C3_N: CONN_A3.120(A72) CONN_B.112(A56)
MGT_B230_RX1_C4_P: CONN_A3.119(A70) CONN_B.111(A54)
MGT_B230_RX2_B1_N: CONN_A3.123(A78) CONN_B.115(A62)
MGT_B230_RX2_B2_P: CONN_A3.122(A76) CONN_B.114(A60)
MGT_B230_RX3_A3_N: CONN_A3.125(A82) CONN_B.118(A68)
MGT_B230_RX3_A4_P: CONN_A3.124(A80) CONN_B.117(A66)
MGT_B230_TX0_D5_N: CONN_A3.32(A63) CONN_B.24(A47)
MGT_B230_TX0_D6_P: CONN_A3.31(A61) CONN_B.23(A45)
MGT_B230_TX1_C7_N: CONN_A3.35(A69) CONN_B.27(A53)
MGT_B230_TX1_C8_P: CONN_A3.34(A67) CONN_B.26(A51)
MGT_B230_TX2_B5_N: CONN_A3.41(A81) CONN_B.33(A65)
MGT_B230_TX2_B6_P: CONN_A3.40(A79) CONN_B.32(A63)
MGT_B230_TX3_A7_N: CONN_A3.43(A85) CONN_B.36(A71)
MGT_B230_TX3_A8_P: CONN_A3.42(A83) CONN_B.35(A69)
MGTPS_REFCLK0_P25_P: CONN_A3.94(A20) CONN_B.86(A4)
MGTPS_REFCLK0_P26_N: CONN_A3.95(A22) CONN_B.87(A6)
MGTPS_REFCLK1_M25_P: CONN_A3.12(A23) CONN_B.4(A7)
MGTPS_REFCLK1_M26_N: CONN_A3.13(A25) CONN_B.5(A9)
MGTPS_RX0_T29_P: CONN_A3.100(A32) CONN_B.92(A16)
MGTPS_RX0_T30_N: CONN_A3.102(A36) CONN_B.94(A20)
MGTPS_RX1_P29_P: CONN_A3.104(A40) CONN_B.96(A24)
MGTPS_RX1_P30_N: CONN_A3.106(A44) CONN_B.98(A28)
MGTPS_RX2_M29_P: CONN_A3.108(A48) CONN_B.100(A32)
MGTPS_RX2_M30_N: CONN_A3.110(A52) CONN_B.102(A36)
MGTPS_RX3_K29_P: CONN_A3.112(A56) CONN_B.104(A40)
MGTPS_RX3_K30_N: CONN_A3.114(A60) CONN_B.106(A44)
MGTPS_TX0_R27_P: CONN_A3.15(A29) CONN_B.7(A13)
MGTPS_TX0_R28_N: CONN_A3.17(A33) CONN_B.9(A17)
MGTPS_TX1_N27_P: CONN_A3.19(A37) CONN_B.11(A21)
MGTPS_TX1_N28_N: CONN_A3.21(A41) CONN_B.13(A25)
MGTPS_TX2_L27_P: CONN_A3.23(A45) CONN_B.15(A29)
MGTPS_TX2_L28_N: CONN_A3.25(A49) CONN_B.17(A33)
MGTPS_TX3_J27_P: CONN_A3.27(A53) CONN_B.19(A37)
MGTPS_TX3_J28_N: CONN_A3.29(A57) CONN_B.21(A41)
N$1: JP1.1 R1.2
N$2: JTAG.4 RN1.1
N$3: IC2.1(D1+) RN1.8
N$4: JTAG.6 RN1.2
N$5: JTAG.8 RN1.3
N$6: JTAG.10 RN1.4
N$7: IC2.3(D2+) RN1.7
N$8: LED1.C Q3.6(TR1_DRAIN)
N$9: LED1.A R3.2
N$10: IC3.1(D1+) RN1.6
N$11: IC3.3(D2+) RN1.5
N$12: LED2.C Q3.3(TR2_DRAIN)
N$13: LED2.A R4.2
N$14: Q2.3(TR2_DRAIN) Q3.4(TR2_SOURCE)
N$15: Q2.4(TR2_SOURCE) Q2.6(TR1_DRAIN)
N$16: C13.1 D1.2(A) Q1.5(TR2_GATE) Q1.6(TR1_DRAIN) R8.1 R10.2
N$17: LED3.C Q1.3(TR2_DRAIN)
N$18: LED3.A R9.2
N$19: CONN_A.39(A77)
N$20: C14.1 IC4.3(CT)
N$21: IC4.1(VOUT) R5.1
N$22: CONN_A.21(A41)
N$337: R901.1 SDIO_LEVEL_SHIFTER.13(CLKB1)
PS_DONE: CONN_A.149(A130) Q3.2(TR1_GATE) R2.2
PS_MIO38_UARTRX: CONN_A.53(A105)
PS_MIO39_UARTTX: CONN_A.54(A107)
PS_MIO40: CONN_A1.157(A146) CONN_A.125(A82)
PS_MIO41: CONN_A1.158(A148) CONN_A.126(A84)
PS_MIO42_PERST#: CONN_A1.167(A166) CONN_A.136(A104)
PS_MIO43: CONN_A1.168(A168) CONN_A.137(A106)
PS_MIO44: CONN_A1.165(A162) CONN_A.134(A100)
PS_MIO45_SDCD#: CONN_A1.164(A160) CONN_A.133(A98)
PS_MIO46_SDD0: CONN_A.48(A95) SDIO_LEVEL_SHIFTER.6(DAT0A)
PS_MIO47_SDD1: CONN_A.49(A97) SDIO_LEVEL_SHIFTER.7(DAT1A)
PS_MIO48_SDD2: CONN_A.51(A101) SDIO_LEVEL_SHIFTER.1(DAT2A)
PS_MIO49_SDD3: SDIO_LEVEL_SHIFTER.3(DAT3A)
PS_MIO50_SDCMD: CONN_A.47(A93) SDIO_LEVEL_SHIFTER.4(CMDA)
PS_MIO51_SDCLK: CONN_A.46(A91) R900.1 R900.2 SDIO_LEVEL_SHIFTER.9(CLKA)
PS_MIO_49_SDD3: CONN_A.52(A103)
PS_POR#: C12.1 CONN_A.150(A132) SW1.P$1
PS_SRST#: C2.1 CONN_A.146(A124) JTAG.14 SW2.P$1
PWR_EN: CONN_A.89(A10) D1.1(K) R5.2 R6.2
PWR_GOOD: CONN_A.90(A12) Q1.2(TR1_GATE) Q2.2(TR1_GATE) R6.1
SDCARD_CD#: D7.1(I/O_&_THERMAL_PAD) MICRO_SD_CARD_SLOT.DT(DETECT)
SDCARD_CLK: D6.1(I/O_&_THERMAL_PAD) MICRO_SD_CARD_SLOT.5(CLK) R901.2
SDCARD_CMD: D4.1(I/O_&_THERMAL_PAD) MICRO_SD_CARD_SLOT.3(CMD) SDIO_LEVEL_SHIFTER.12(CMDB1)
SDCARD_D0: D9.1(I/O_&_THERMAL_PAD) MICRO_SD_CARD_SLOT.7(DAT0) SDIO_LEVEL_SHIFTER.14(DAT0B1)
SDCARD_D1: D8.1(I/O_&_THERMAL_PAD) MICRO_SD_CARD_SLOT.8(DAT1) SDIO_LEVEL_SHIFTER.15(DAT1B1)
SDCARD_D2: D2.1(I/O_&_THERMAL_PAD) MICRO_SD_CARD_SLOT.1(DATA2) SDIO_LEVEL_SHIFTER.8(DAT2B1)
SDCARD_D3: D3.1(I/O_&_THERMAL_PAD) MICRO_SD_CARD_SLOT.2(CD/DAT3) SDIO_LEVEL_SHIFTER.10(DAT3B1)
USB_CPEN: CONN_A.148(A128)
USB_D_N: CONN_A.65(A129) IC1.6(D1-) J1.2
USB_D_P: CONN_A.64(A127) IC1.1(D1+) J1.3
USB_SSRX_N: CONN_A.71(A141)
USB_SSRX_P: CONN_A.69(A137)
USB_SSTX_N: CONN_A.154(A140)
USB_SSTX_P: CONN_A.152(A136)
USBH_D_N: CONN_A.67(A133)
USBH_D_P: CONN_A.66(A131) J1.1
VBUS_DETECT: CONN_A.139(A110)
VCC_1V8: CONN_B.110(A52) CONN_B.122(A76) CONN_B.138(A108) CONN_B.148(A128) CONN_C.42(A83) CONN_C.62(A123) CONN_C.83(A165)
VCC_2V5: CONN_A.27(A53) CONN_A.33(A65) CONN_A.45(A89) CONN_A.115(A62)
VCC_3V3: C1.1 CONN_A1.42(A83) CONN_A1.43(A85) CONN_A1.44(A87) CONN_A1.45(A89) CONN_A1.46(A91) CONN_A1.47(A93) CONN_A1.48(A95) CONN_A1.49(A97) CONN_A1.50(A99) CONN_A.15(A29) CONN_A.97(A26) CONN_A.109(A50) CONN_A.127(A86) CONN_B.28(A55) CONN_B.40(A79) CONN_B.58(A115) CONN_B.64(A127) CONN_B.78(A155) CONN_B.160(A152) CONN_C.52(A103) CONN_C.72(A143) CONN_C.132(A96) CONN_C.152(A136) JTAG.2 MICRO_SD_CARD_SLOT.4(VDD) R3.1 R4.1 SDIO_LEVEL_SHIFTER.17(VCCB1)
VCC_BAT: CONN_A.168(A168)
VCC_CFG_MIO: C9.1 C10.1 C11.1 CONN_A.121(A74) IC4.2(SUB) IC4.4(VDD) SDIO_LEVEL_SHIFTER.5(VCCA) SDIO_LEVEL_SHIFTER.24(SEL) VCC_1.1
VCC_IO: C6.1 C7.1 C8.1 CONN_A1.32(A63) CONN_A1.33(A65) CONN_A1.34(A67) CONN_A1.35(A69) CONN_A1.36(A71) CONN_A1.37(A73) CONN_A1.38(A75) CONN_A1.39(A77) CONN_A1.40(A79) CONN_A3.1(A1) CONN_A3.2(A3) CONN_A3.3(A5) CONN_A3.4(A7) CONN_A3.5(A9) CONN_A3.6(A11) CONN_A3.7(A13) CONN_A3.85(A2) CONN_A3.86(A4) CONN_A3.87(A6) CONN_A3.88(A8) CONN_A3.89(A10) CONN_A3.90(A12) CONN_A3.91(A14) CONN_A.103(A38) CONN_B.34(A67) CONN_B.116(A64) CONN_B.128(A88) CONN_B.154(A140) CONN_C.122(A76) CONN_C.142(A116) CONN_C.163(A158) VCC_2.1
VCC_IO_B47: Q3.5(TR2_GATE)
VCC_IO_B65: Q2.5(TR2_GATE)
VCC_IO_B66: CONN_B.48(A95) CONN_B.72(A143)
VCC_MISC: CONN_A1.22(A43) CONN_A1.23(A45) CONN_A1.24(A47) CONN_A1.25(A49) CONN_A1.26(A51) CONN_A1.27(A53) CONN_A1.28(A55) CONN_A1.29(A57) CONN_A1.30(A59)
VCC_MOD: C3.1 C4.1 C5.1 CONN_A1.1(A1) CONN_A1.2(A3) CONN_A1.3(A5) CONN_A1.4(A7) CONN_A1.5(A9) CONN_A1.6(A11) CONN_A1.7(A13) CONN_A1.8(A15) CONN_A1.9(A17) CONN_A1.10(A19) CONN_A1.11(A21) CONN_A1.12(A23) CONN_A1.13(A25) CONN_A1.14(A27) CONN_A1.15(A29) CONN_A1.16(A31) CONN_A1.17(A33) CONN_A1.18(A35) CONN_A1.19(A37) CONN_A1.20(A39) CONN_A2.1(A1) CONN_A2.2(A3) CONN_A2.3(A5) CONN_A2.4(A7) CONN_A2.5(A9) CONN_A2.85(A2) CONN_A2.86(A4) CONN_A2.87(A6) CONN_A2.88(A8) CONN_A2.89(A10) CONN_A.1(A1) CONN_A.2(A3) CONN_A.3(A5) CONN_A.4(A7) CONN_A.5(A9) CONN_A.6(A11) CONN_A.85(A2) CONN_A.86(A4) CONN_A.87(A6) CONN_A.88(A8) R8.2 R9.1 VCC_5V.3
VMON_0V9: CONN_B.84(A167)
VMON_1V2_BAT: CONN_B.88(A8)
VMON_1V8: CONN_B.168(A168)
VMON_INT: CONN_A.135(A102)
VMON_PSINT: CONN_C.88(A8)
Unconnected: CONN_A1.97(A26) CONN_A1.98(A28) CONN_A1.99(A30) CONN_A1.100(A32) CONN_A1.101(A34) CONN_A1.102(A36) CONN_A1.103(A38) CONN_A1.104(A40) CONN_A1.105(A42) CONN_A1.106(A44) CONN_A1.107(A46) CONN_A1.108(A48) CONN_A1.109(A50) CONN_A1.110(A52) CONN_A1.111(A54) CONN_A1.112(A56) CONN_A1.113(A58) CONN_A1.114(A60) CONN_A1.115(A62) CONN_A1.116(A64) CONN_A1.117(A66) CONN_A1.118(A68) CONN_A1.119(A70) CONN_A1.120(A72) CONN_A1.121(A74) CONN_A1.122(A76) CONN_A1.123(A78) CONN_A1.124(A80) CONN_A1.125(A82) CONN_A1.126(A84) IC1.5(NC) IC2.5(NC) IC3.5(NC) JTAG.12 SDIO_LEVEL_SHIFTER.16(DAT1B0) SDIO_LEVEL_SHIFTER.18(DA0B0) SDIO_LEVEL_SHIFTER.19(CLKB0) SDIO_LEVEL_SHIFTER.20(CMDB0) SDIO_LEVEL_SHIFTER.21(VCCB0) SDIO_LEVEL_SHIFTER.22(DAT3B0) SDIO_LEVEL_SHIFTER.23(DAT2B0) VCC_5V.1

## Notes on the sheet
- Buttons and Jumpers | Power
- Indicator LEDs
- Connectors
- Mercury+ XU1 | Daughter Board
- SD Card
- USB

## Library data of the parts
C1-C14 = rcl:C-US: CAPACITOR, American symbol; SPICEPREFIX: C
CONN1 = con-coax:BN35N61: BNC CONNECTOR M/A COM www.macom.com distributor Farnell 149-452; OC_FARNELL: unknown; OC_NEWARK: unknown; SPICEPREFIX: X
CONN2 CONN3 VCC_1 VCC_2 = con-coax:BN35N61: BNC CONNECTOR M/A COM www.macom.com distributor Farnell 149-452; OC_FARNELL: unknown; OC_NEWARK: unknown
CONN_A CONN_A1-CONN_A3 CONN_B CONN_C = SamacSys_Parts:FX10A-168P-SV(71): Hirose FX10 Series, 0.5mm Pitch 168 Way 2 Row Straight PCB Header, Solder Termination, 0.3A Source: Datasheet <https://componentsearchengine.com/Datasheets/1/FX10A-168P-SV(71).pdf>; DESCRIPTION: Hirose FX10 Series, 0.5mm Pitch 168 Way 2 Row Straight PCB Header, Solder Termination, 0.3A; HEIGHT: mm; MANUFACTURER_NAME: Hirose; MANUFACTURER_PART_NUMBER: FX10A-168P-SV(71); MOUSER_PART_NUMBER: 798-FX10A168PSV71; MOUSER_PRICE-STOCK: https://www.mouser.com/Search/Refine.aspx?Keyword=798-FX10A168PSV71
D1 = SamacSys_Parts:BAS40SL: ON Semi BAS40SL SMT Schottky Diode, 40V 100mA, 2-Pin SOD-923F Source: Datasheet <https://componentsearchengine.com/Datasheets/1/BAS40SL.pdf>; DESCRIPTION: ON Semi BAS40SL SMT Schottky Diode, 40V 100mA, 2-Pin SOD-923F; HEIGHT: 0.43mm; MANUFACTURER_NAME: ON Semiconductor; MANUFACTURER_PART_NUMBER: BAS40SL; MOUSER_PART_NUMBER: 512-BAS40SL; MOUSER_PRICE-STOCK: https://www.mouser.com/Search/Refine.aspx?Keyword=512-BAS40SL
D2-D4 D6-D9 = SamacSys_Parts:TPD1E6B06DPLR: Texas Instruments TPD1E6B06DPLR Bi-Directional TVS Diode, 50W peak, 2-Pin X2SON Source: Datasheet <http://www.ti.com/lit/ds/symlink/tpd1e6b06.pdf>; DESCRIPTION: Texas Instruments TPD1E6B06DPLR Bi-Directional TVS Diode, 50W peak, 2-Pin X2SON; HEIGHT: mm; MANUFACTURER_NAME: Texas Instruments; MANUFACTURER_PART_NUMBER: TPD1E6B06DPLR; MOUSER_PART_NUMBER: 595-TPD1E6B06DPLR; MOUSER_PRICE-STOCK: https://www.mouser.com/Search/Refine.aspx?Keyword=595-TPD1E6B06DPLR
IC1-IC3 = SamacSys_Parts:TPD4E1U06DBVR: Quad High Speed ESD Protection SOT-23-6 Texas Instruments TPD4E1U06DBVR Quad Uni-Directional ESD Protection Array, 45W peak, 6-Pin SOT-23 Source: Datasheet <http://www.ti.com/lit/ds/symlink/tpd4e1u06.pdf>; DESCRIPTION: Quad High Speed ESD Protection SOT-23-6 Texas Instruments TPD4E1U06DBVR Quad Uni-Directional ESD Protection Array, 45W peak, 6-Pin SOT-23; HEIGHT: 1.45mm; MANUFACTURER_NAME: Texas Instruments; MANUFACTURER_PART_NUMBER: TPD4E1U06DBVR; MOUSER_PART_NUMBER: 595-TPD4E1U06DBVR; MOUSER_PRICE-STOCK: https://www.mouser.com/Search/Refine.aspx?Keyword=595-TPD4E1U06DBVR
IC4 = SamacSys_Parts:BU4230FVE-TR: ROHM BU4230FVE-TR, Voltage Detector 3.03V max., 5-Pin VSOF Source: Datasheet <https://componentsearchengine.com/Datasheets/1/BU4230FVE-TR.pdf>; DESCRIPTION: ROHM BU4230FVE-TR, Voltage Detector 3.03V max., 5-Pin VSOF; HEIGHT: mm; MANUFACTURER_NAME: ROHM Semiconductor; MANUFACTURER_PART_NUMBER: BU4230FVE-TR; MOUSER_PART_NUMBER: 755-BU4230FVE-TR; MOUSER_PRICE-STOCK: https://www.mouser.com/Search/Refine.aspx?Keyword=755-BU4230FVE-TR
J1 = SamacSys_Parts:USBR-A-S-F-O-TH: High-Retention USB 2.0 Interface, Type A Source: Datasheet <https://componentsearchengine.com/Datasheets/1/USBR-A-S-F-O-TH.pdf>; DESCRIPTION: High-Retention USB 2.0 Interface, Type A; HEIGHT: mm; MANUFACTURER_NAME: SAMTEC; MANUFACTURER_PART_NUMBER: USBR-A-S-F-O-TH; MOUSER_PART_NUMBER: 200-USBRASFOTH; MOUSER_PRICE-STOCK: https://www.mouser.com/Search/Refine.aspx?Keyword=200-USBRASFOTH
JP1 = jumper:JP1E: JUMPER
JTAG = con-lstb:MA07-2: PIN HEADER; OC_FARNELL: unknown; OC_NEWARK: unknown
LED1-LED3 = adafruit:LED: LED OSRAM: - CHIPLED LG R971, LG N971, LY N971, LG Q971, LY Q971, LO R971, LY R971 LH N974, LH R974 LS Q976, LO Q976, LY Q976 LO Q996 - Hyper CHIPLED LW Q18S LB Q993, LB Q99A, LB R99A - SideLED LS A670, LO A670, LY A670, LG A670, LP A670 LB A673, LV A673, LT A673, LW A673 LH A674 LY A675 LS A676, LA A676, LO A676, LY A676, LW A676 LS A679, LY A679, LG A679 - Hyper Micro SIDELED® LS Y876, LA Y876, LO Y876, LY Y876 LT Y87S - SmartLED LW L88C, LW L88S LB L89C, LB L89S, LG L890 LS L89K, LO L89K, LY L89K LS L896, LA L896, LO L896, LY L896 - TOPLED LS T670, LO T670, LY T670, LG T670, LP T670 LSG T670, LSP T670, LSY T670, LOP T670, LYG T670 LG T671, LOG T671, LSG T671 LB T673, LV T673, LT T673, LW T673 LH T674 LS T676, LA T676, LO T676, LY T676, LB T676, LH T676, LSB T676, LW T676 LB T67C, LV T67C, LT T67C, LS T67K, LO T67K, LY T67K, LW E67C LS E67B, LA E67B, LO E67B, LY E67B, LB E67C, LV E67C, LT E67C LW T67C LS T679, LY T679, LG T679 LS T770, LO T770, LY T770, LG T770, LP T770 LB T773, LV T773, LT T773, LW T773 LH T774 LS E675, LA E675, LY E675, LS T675 LS T776, LA T776, LO T776, LY T776, LB T776 LHGB T686 LT T68C, LB T68C - Hyper Mini TOPLED® LB M676 - Mini TOPLED Santana® LG M470 LS M47K, LO M47K, LY M47K Source: http://www.osram.convergy.de/
MICRO_SD_CARD_SLOT = 503182-1852:503182-1852: Conn Micro SD Card M 8 POS 1.09mm Solder RA SMD Embossed T/R 0.5A/Contact; DESCRIPTION: 10 _8 + 2_ Position Card Connector microSD™ Surface Mount, Right Angle Gold; DIGI-KEY_PART_NUMBER: WM12834CT-ND; DIGI-KEY_PURCHASE_URL: https://www.digikey.com/product-detail/en/molex/5031821852/WM12834CT-ND/5823232?utm_source=snapeda&utm_medium=aggregator&utm_campaign=symbol; MF: Molex; MP: 5031821852; PACKAGE: None
Q1-Q3 = SamacSys_Parts:EM6K6T2R: MOSFET,dual,N-channel,20V,200mA,SOT563 Source: Datasheet <https://componentsearchengine.com/Datasheets/1/EM6K6T2R.pdf>; DESCRIPTION: MOSFET,dual,N-channel,20V,200mA,SOT563; HEIGHT: 0.55mm; MANUFACTURER_NAME: ROHM Semiconductor; MANUFACTURER_PART_NUMBER: EM6K6T2R; MOUSER_PART_NUMBER: 755-EM6K6T2R; MOUSER_PRICE-STOCK: https://www.mouser.com/Search/Refine.aspx?Keyword=755-EM6K6T2R
R1-R6 R8-R10 R900 R901 = rcl:R-US_: RESISTOR, American symbol; SPICEPREFIX: R
RN1 = resistor-dil:4R-N: Array Chip Resistor Source: RS Component / Phycomp; OC_FARNELL: unknown; OC_NEWARK: unknown
SDIO_LEVEL_SHIFTER = SamacSys_Parts:TXS02612RTWR: SDIO Port Expander With Voltage-Level Translation Source: Datasheet <http://www.ti.com/lit/gpn/txs02612>; DESCRIPTION: SDIO Port Expander With Voltage-Level Translation; HEIGHT: 0.8mm; MANUFACTURER_NAME: Texas Instruments; MANUFACTURER_PART_NUMBER: TXS02612RTWR; MOUSER_PART_NUMBER: 595-TXS02612RTWR; MOUSER_PRICE-STOCK: https://www.mouser.com/Search/Refine.aspx?Keyword=595-TXS02612RTWR
SW1 SW2 = adafruit:SWITCH_PUSHBUTTON: Buttons SOFTTOUCHSMD_SJ - Soft touch temporary push button (Super Junk Akihabara) Compatible with SKPMANE010 [Mouser: 688-SKPMAN] C&K_KSS = Digikey: KSS221GLFS
VCC_5V = con-jack:JACK-PLUG: DC POWER JACK Power Jack, DC, Right Angle, Through Hole, Rated 5A at 16VDC, PC Terminals Distributor: Farnell (www.Farnell.de) Drawing: 84N1161.pdf / 84N1162.pdf Manufacturer: SPC Technology (www.spctechnology.com) Type: SPC4077 / SPC 4078; OC_FARNELL: unknown; OC_NEWARK: unknown